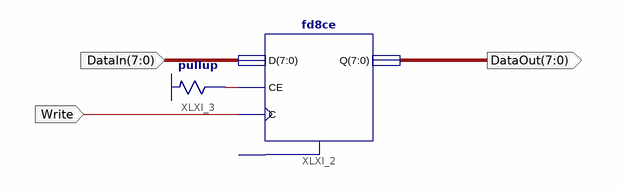
[diagram p0: schematic sheet 1]
// Xilinx ISE schematic Register.sch (spartan3e) as structural Verilog: 2 symbols, 3 ports
module Register (
  input  [7:0] DataIn,
  input  Write,
  output [7:0] DataOut
);

  wire XLXN_4;

  fd8ce XLXI_2 (.C(Write), .CE(XLXN_4), .D(DataIn), .Q(DataOut));  // open: CLR
  \pullup  XLXI_3 (.O(XLXN_4));
endmodule
